# Altium schematic sheet Sheet3.SchDoc
size 209 x 297 mm; SheetNumber: 3; SheetTotal: 3
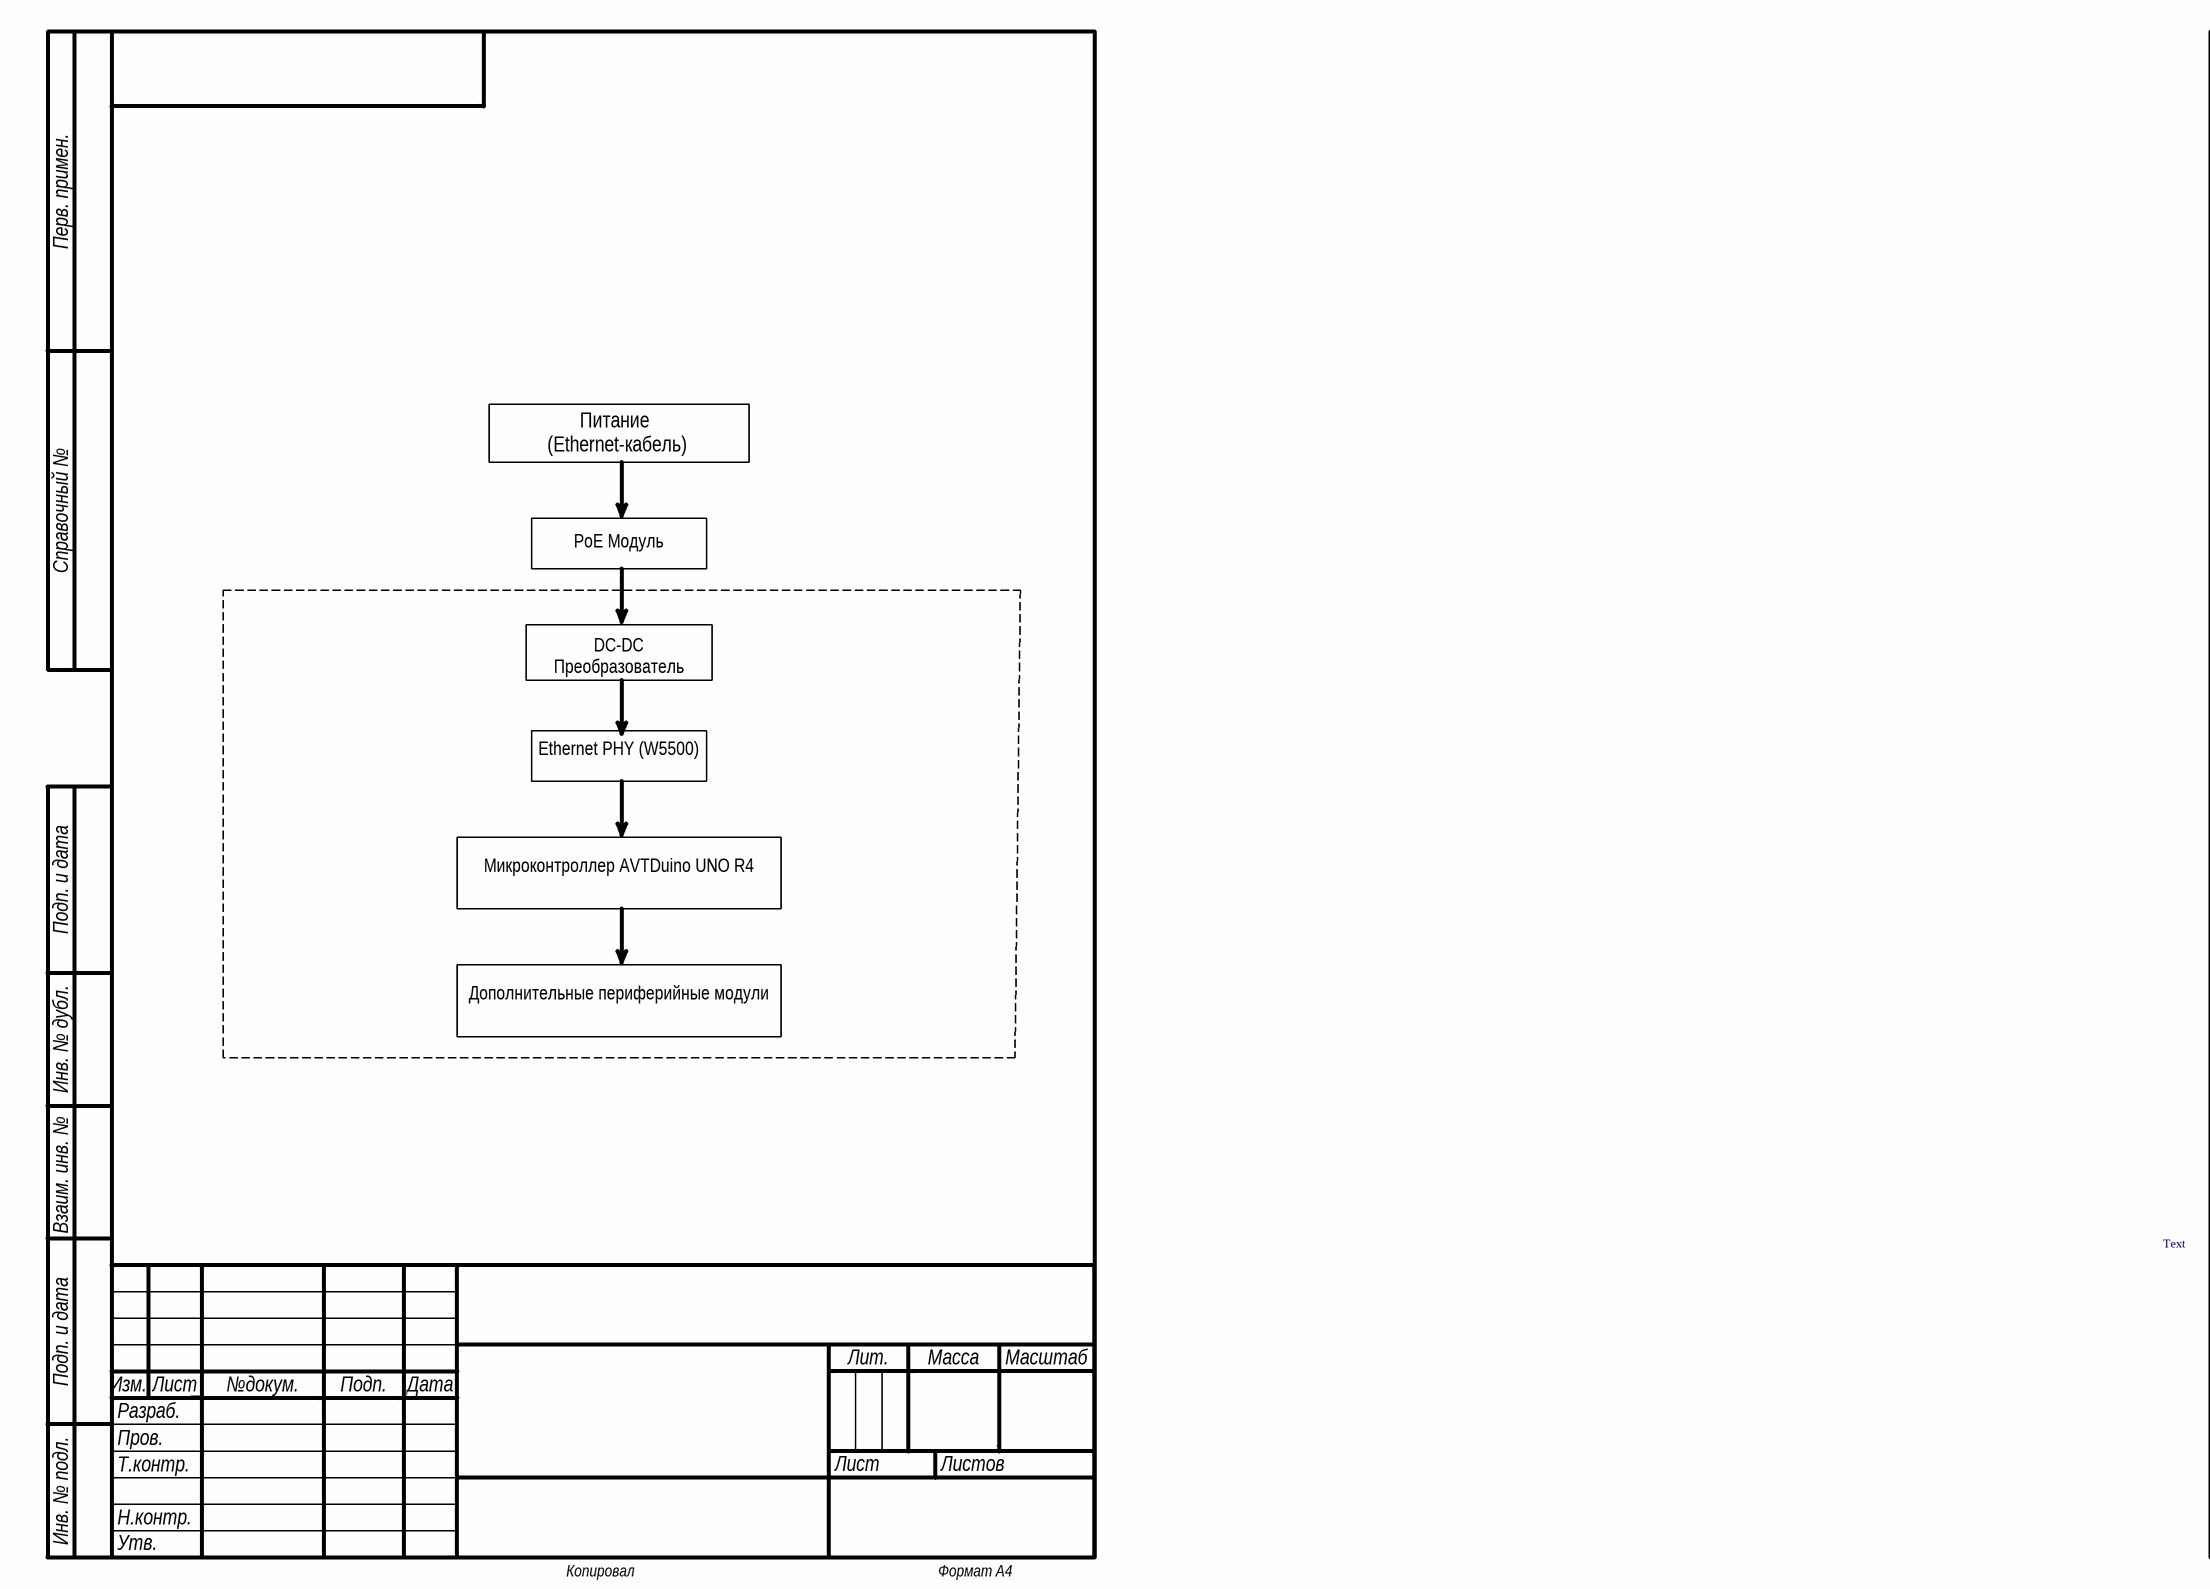
[diagram p0: Sheet3.SchDoc]

## Notes on the sheet
- Питание
  (Ethernet-кабель)
- PoE Модуль
- DC-DC Преобразователь
  (12V-5V)
- Ethernet PHY (W5500)
- Микроконтроллер AVTDuino UNO R4 PLUS
- Дополнительные периферийные модули
- Text
- Перв. примен.
- Справочный №
- Подп. и дата
- Инв. № дубл.
- Взаим. инв. №
- Разраб.
- Изм.
- Лист
- №докум.
- Подп.
- Дата
- Лит.
- Масса
- Масштаб
- Пров.
- Т.контр.
- Листов
- Инв. № подл.
- Н.контр.
- Утв.
- Копировал
- Формат A4